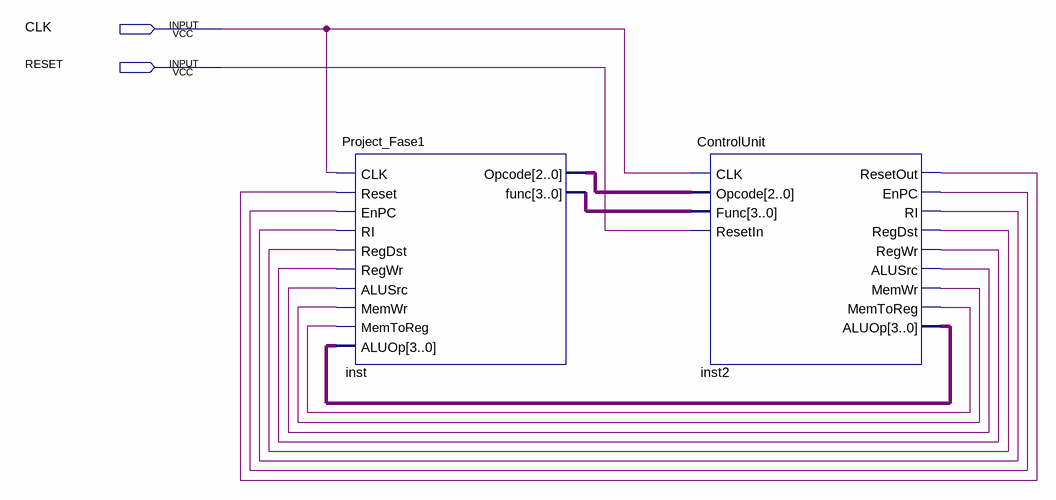
[diagram p0: schematic sheet]
// Quartus schematic MicroProcessor_Visual.bdf as structural Verilog: 2 symbols, 2 pins
module MicroProcessor_Visual (
  input  CLK,
  input  RESET
);

  wire inst2_alusrc, inst2_enpc, inst2_memtoreg, inst2_memwr, inst2_regdst, inst2_regwr, inst2_resetout,
       inst2_ri;
  wire [2:0] inst_opcode;
  wire [3:0] inst2_aluop, inst_func;

  Project_Fase1 inst (
    .CLK(CLK), .Reset(inst2_resetout), .EnPC(inst2_enpc), .RI(inst2_ri), .RegDst(inst2_regdst),
    .RegWr(inst2_regwr), .ALUSrc(inst2_alusrc), .MemWr(inst2_memwr), .MemToReg(inst2_memtoreg),
    .ALUOp(inst2_aluop), .Opcode(inst_opcode), .func(inst_func));
  ControlUnit inst2 (
    .CLK(CLK), .Opcode(inst_opcode), .Func(inst_func), .ResetIn(RESET), .ResetOut(inst2_resetout),
    .EnPC(inst2_enpc), .RI(inst2_ri), .RegDst(inst2_regdst), .RegWr(inst2_regwr), .ALUSrc(inst2_alusrc),
    .MemWr(inst2_memwr), .MemToReg(inst2_memtoreg), .ALUOp(inst2_aluop));
endmodule
